# Altium schematic sheet Sheet2.SchDoc
size A4; SheetNumber: 1; SheetTotal: 1
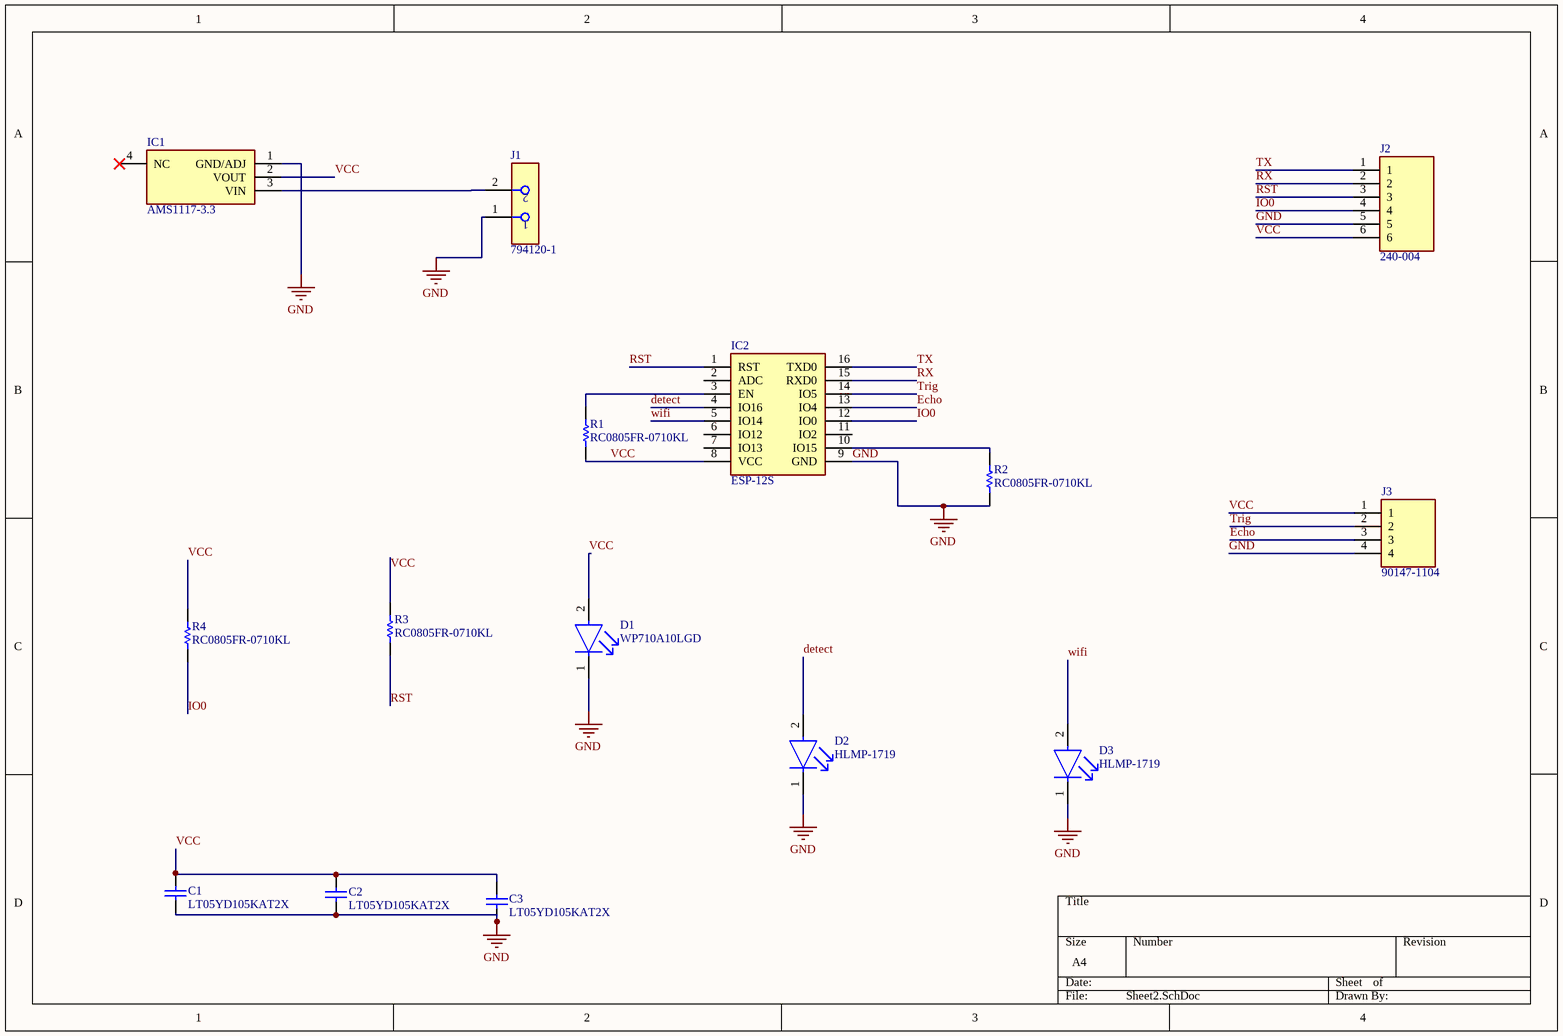
[diagram p0: Sheet2.SchDoc]

## Parts
C1  LT05YD105KAT2X  [CAPC2013X130X50NL20T25]
C2  LT05YD105KAT2X  [CAPC2013X130X50NL20T25]
C3  LT05YD105KAT2X  [CAPC2013X130X50NL20T25]
D1  WP710A10LGD  [FP-WP710A10LGD-MFG]
D2  HLMP-1719  [FP-HLMP-1719-MFG]
D3  HLMP-1719  [FP-HLMP-1719-MFG]
IC1  AMS1117-3.3  [SOT229P700X180-4N]
IC2  ESP-12S  [ESP12S]
J1  794120-1  [FP-794120-1-MFG]
J2  240-004  [HDRV6W64P0X254_1X6_1524X254X909P]
J3  90147-1104  [RHDR4W70P0X254_1X4_1016X244X870P]
R1  RC0805FR-0710KL  [RESC2013X60X35NL10T20]
R2  RC0805FR-0710KL  [RESC2013X60X35NL10T20]
R3  RC0805FR-0710KL  [RESC2013X60X35NL10T20]
R4  RC0805FR-0710KL  [RESC2013X60X35NL10T20]

## Nets
GND: C1.1 C2.1 C3.1 D1.1(C) D2.1(C) D3.1(C) IC1.1(GND/ADJ) IC2.9(GND) J1.1 J2.5 J3.4 R2.1
detect: D2.2(A) IC2.4(IO16)
Echo: IC2.13(IO4) J3.3
IO0: IC2.12(IO0) J2.4 R4.1
RST: IC2.1(RST) J2.3 R3.1
RX: IC2.15(RXD0) J2.2
Trig: IC2.14(IO5) J3.2
TX: IC2.16(TXD0) J2.1
VCC: C1.2 C2.2 C3.2 D1.2(A) IC1.2(VOUT) IC2.8(VCC) J2.6 J3.1 R1.1 R3.2 R4.2
wifi: D3.2(A) IC2.5(IO14)
NetIC1_3: IC1.3(VIN) J1.2
NetIC2_3: IC2.3(EN) R1.2
NetIC2_10: IC2.10(IO15) R2.2

Not connected (* = marked no-connect by the designer): IC1 4(NC)*; IC2 2(ADC) 6(IO12) 7(IO13) 11(IO2)

## Library data of the parts
C1-C3 = CMP-2007-04819-1: Manufacturer: AVX Interconnect / Elco; Part Number: LT05YD105KAT2X
D1 = CMP-00682-20090258-1: WP710A10LGD LED Thru-Hole PCB Green T-1 3mm Green Lens 2 mA 568 nm 2 mcd Round; Number of LEDs: 1; Max Junction Temperature (Tj): 110°C; Viewing Angle: 40°; Reverse Voltage: 5V; Forward Voltage: 1.9V; Dominant Wavelength: 568nm; Luminous Intensity: 2mcd; Power Rating: 62.5mW; Forward Current: 2mA; Lens Style: Diffused, Dome, Round, Tinted; Height: 4.6mm; Mount: Through Hole; Illumination Color: Green; NexarPartId: 20090258; Number of Pins: 3; RoHS: Compliant; Max Operating Temperature: 85°C; Min Operating Temperature: -40°C; Lens Color: Green; Wavelength: 568nm; Color: Green; Schedule B: 8541402000, 8541402000; Case/Package: Radial; Power Dissipation: 62.5mW; Lead Free: Lead Free; Test Current: 2mA
D2 D3 = CMP-2000-06410-2: LED YELLOW DIFFUSED T-1 T/H; Manufacturer: Broadcom; Wavelength: 585nm; Led Orientation: Straight; Luminous Intensity: 2.1mcd; Forward Voltage: 1.8V; Viewing Angle: 50°; Reverse Voltage: 5V; Power Dissipation: 17.5mW; Forward Current: 2mA; Lead Free: Yes; Automotive: No; Device Class L1: Optoelectronics; Mouser Description: Standard LEDs - Through Hole Yellow Diffused 585nm 2.1mcd; Digikey Description: LED YELLOW DIFFUSED T-1 T/H; Temperature: -40°C to +100°C; Temperature Range High: +100°C; Package: 0; Category: Diode; Colour: Yellow; Device Class L2: LEDs; ComponentLink2Description: Datasheet; ComponentLink2URL: https://docs.broadcom.com/docs/AV02-1557EN; Temperature Range Low: -40°C; Device Class L3: unset; Octopart: https://octopart.com/hlmp-1719-broadcom-71130405; RoHS: TRUE; Manufacturer Part Number: HLMP-1719
IC1 = AMS1117-3.3: Integrated Circuit; Manufacturer_Name: Advanced; Datasheet Link: https://datasheet.datasheetarchive.com/originals/distributors/Datasheets-28/DSA-550594.pdf; Height: 1.8mm; Manufacturer_Part_Number: AMS1117-3.3
IC2 = ESP-12S: Integrated Circuit; Manufacturer_Name: RF SOLUTIONS; Datasheet Link: https://www.rfsolutions.co.uk/downloads/6253e9e3cab0d503DS-ESP12S-1.pdf; Height: 3mm; Manufacturer_Part_Number: ESP-12S; Mouser Part Number: 223-ESP-12S; Mouser Price/Stock: https://www.mouser.co.uk/ProductDetail/RF-Solutions/ESP-12S?qs=UkDUCjYnTB27YArJ5wHUxg%3D%3D
J1 = CMP-03790-39534315-1: 794120-1 Power Connector, 2 Contact(s), Male, Solder Terminal, Receptacle; Manufacturer Lifecycle Status: ACTIVE; Contact Retention: Without; Current Rating: 12A; Approvals: CSA; PCB Mounting Orientation: Right Angle; Operating Supply Voltage: 250V; Number of Power Positions: 2; Connector System: Wire-to-Board; Connector Type: Pin; Max Voltage Rating (DC): 250.25kV; VDE Tested: No; Pitch: 5.08mm; Number of Ports: 1; Number of Rows: 1; Height: 9.14mm; Material: Nylon; Min Operating Temperature: -67°C; NexarPartId: 39534315; Lifecycle Status: Production; Housing Color: Natural; Contact Gender: Male; Lead Free: Lead Free; Color: Natural; Contact Plating: Tin; Orientation: Right Angle; Contact Material: Bronze, Tin; Max Operating Temperature: 105°C; Housing Material: Nylon; Length: 15.24mm; RoHS: Compliant; Max Voltage Rating (AC): 250V; Termination: Solder; Number of Pins: 2; Voltage Rating: 250V; Radiation Hardening: No; Number of Positions: 2; Sealable: No; Number of Terminals: 2; Circuit Application: Power; Contact Current Rating: 12A; Contact Style: Pin; Flammability Rating: UL94 V-2; Mount: Through Hole; Number of Circuits: 2; ELV: Compliant; Voltage Rating (AC): 250V; Fastening Type: Ramp; Width: 12.3mm; Number of Contacts: 2; Lead Pitch: 5.08mm; REACH SVHC: Unknown
J2 = 240-004: Connector; Manufacturer_Name: Digilent; Datasheet Link: https://digilent.com/reference/_media/reference/test-and-measurement/6-pin-header-gender-changer/163-068-2.pdf; Height: 9.09mm; Manufacturer_Part_Number: 240-004; Arrow Part Number: 240-004; Arrow Price/Stock: https://www.arrow.com/en/products/240-004/digilent?region=nac
J3 = 90147-1104: Connector; Manufacturer_Name: Molex; Height: 8.7mm; Manufacturer_Part_Number: 90147-1104; Mouser Part Number: 538-90147-1104; Mouser Price/Stock: https://www.mouser.co.uk/ProductDetail/Molex/90147-1104?qs=QESXi79X%252BKpRACDRmfEx7Q%3D%3D
R1-R4 = CMP-1659-00013-4: Chip Resistor, 10 KOhm, +/- 1%, 0.125 W, -55 to 155 degC, 0805 (2012 Metric), RoHS, Tape and Reel; Manufacturer: Yageo; Voltage Rating: 150 V; Mount: Surface Mount; ComponentLink1Description: Manufacturer URL; ComponentLink2URL: http://www.yageo.com/documents/recent/PYu-RC_Group_51_RoHS_L_04.pdf; Pins: 2; Length: 2 mm; Min Operating Temperature: -55 degC; Height: 0.5 mm; Mounting Technology: Surface Mount; RoHSCompliant: true; REACH SVHC: No SVHC; ComponentLink1URL: http://www.yageo.com/; Max Operating Temperature: 155 degC; PackageReference: 0805; DatasheetVersion: Rev. 4, 02/2016; Package Quantity: 5000; Packaging: Tape and Reel; ComponentLink2Description: Datasheet; PackageDescription: 2-Pin Surface Mounted Device, Body 2 x 1.25 mm